# EAGLE schematic CurrentSensingConverter (EAGLE 6.6.0)
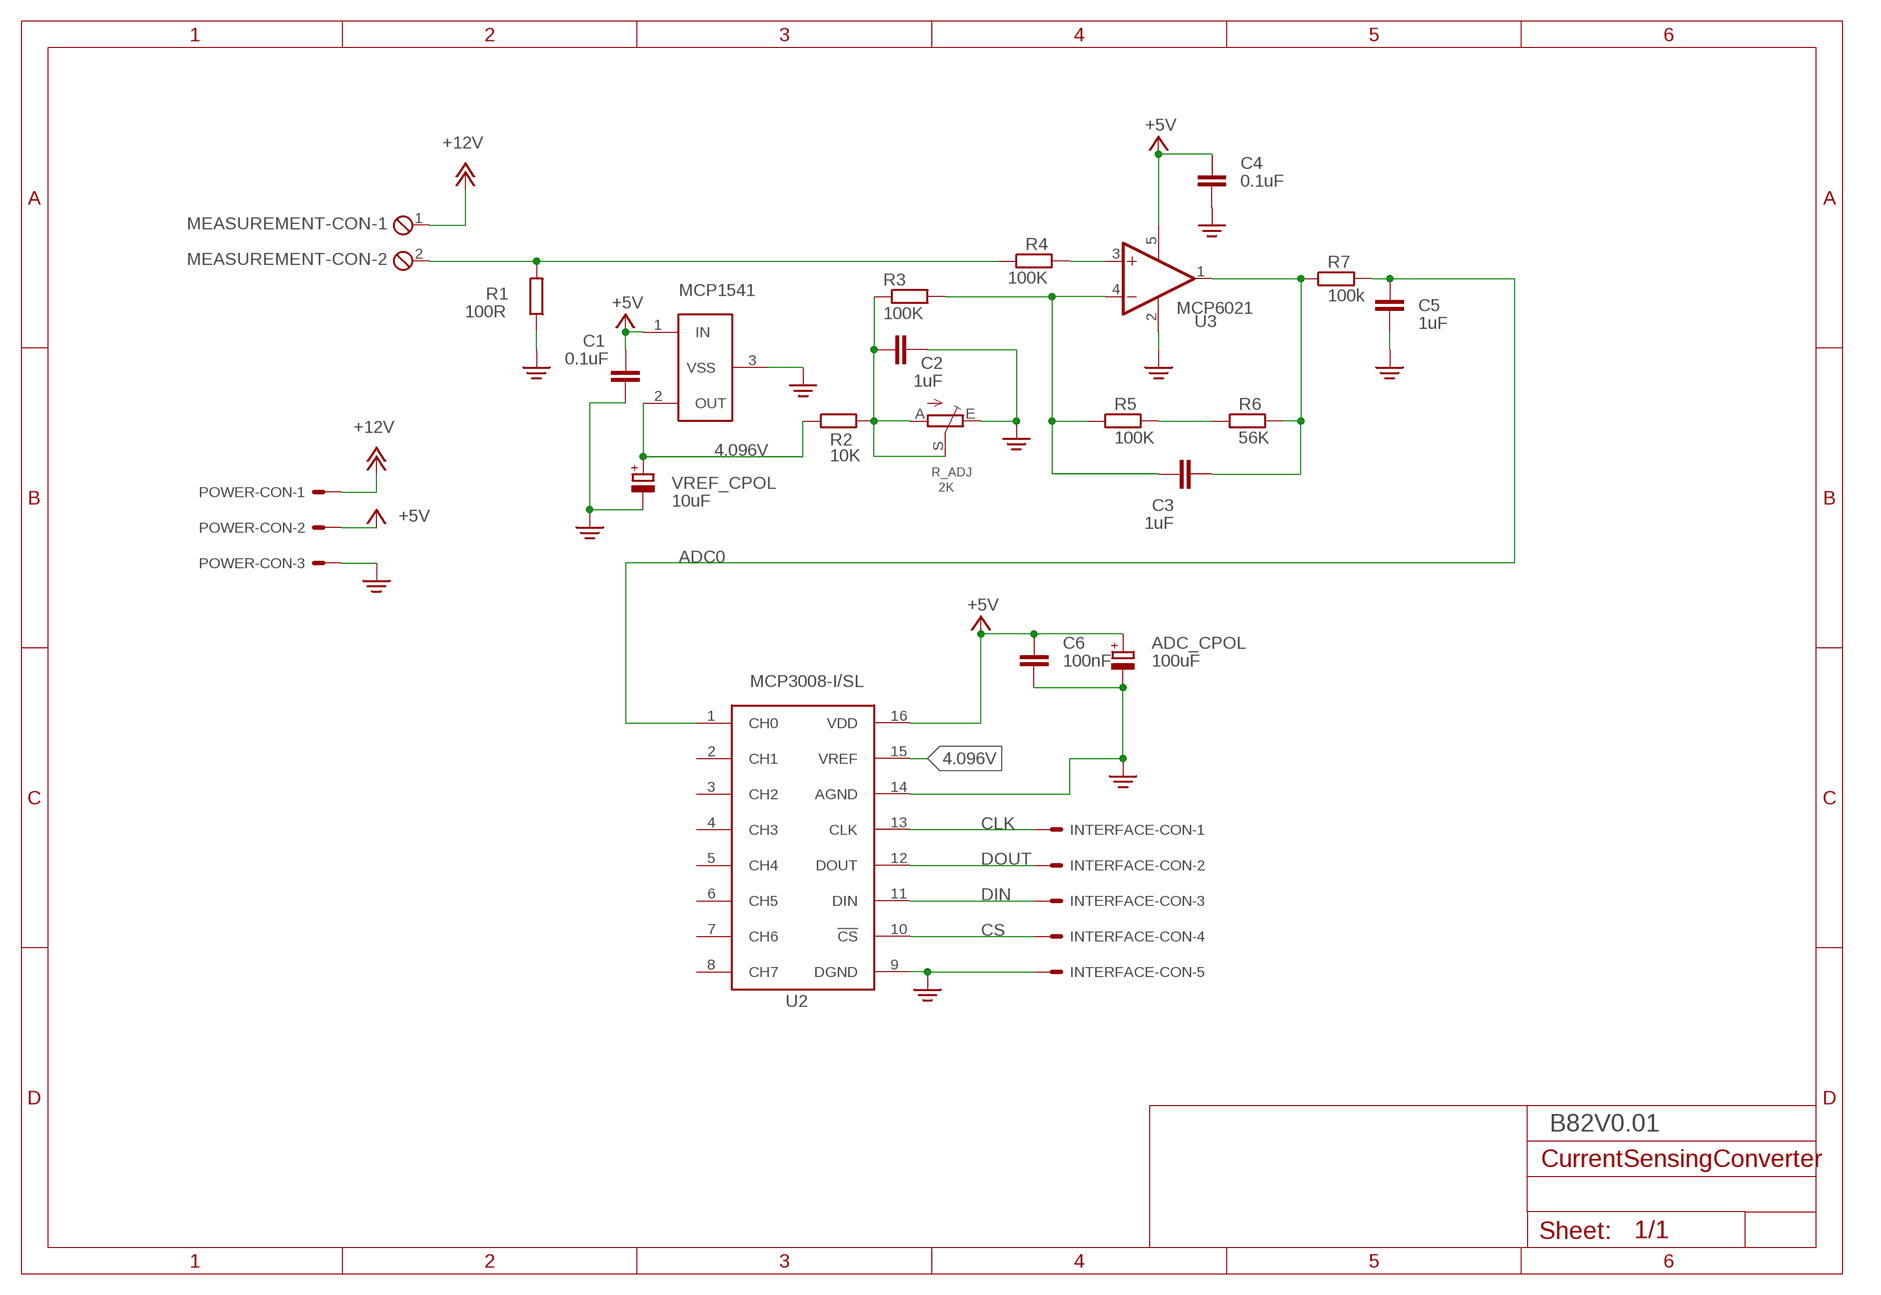
[diagram p0: schematic, sheet 1]

## Parts
ADC_CPOL  100uF  CPOL-EUD/7343-31R  [D/7343-31R]
C1  0.1uF  C-EUC1206  [C1206]
C2  1uF  C-EUC1206  [C1206]
C3  1uF  C-EUC1206  [C1206]
C4  0.1uF  C-EUC1206  [C1206]
C5  1uF  C-EUC1206  [C1206]
C6  100nF  C-EUC1206  [C1206]
INTERFACE-CON  22-05-7058-05  [7395-05]
MEASUREMENT-CON  MPT2  [2POL254]
POWER-CON  22-05-7038-03  [7395-03]
R1  100R  R-EU_R1206  [R1206]
R2  10K  R-EU_R1206  [R1206]
R3  100K  R-EU_R1206  [R1206]
R4  100K  R-EU_R1206  [R1206]
R5  100K  R-EU_R1206  [R1206]
R6  56K  R-EU_R1206  [R1206]
R7  100k  R-EU_R1206  [R1206]
R_ADJ  2K  TRIM_EU-B25P  [B25P]
U1  U1  MCP1541T-I/TT  [SOT23]
U2  MCP3008-I/SL  [SO16]
U3  MCP6021  MCP6021-SOT23  [SOT23-5L]
VREF_CPOL  10uF  CPOL-EUD/7343-31R  [D/7343-31R]

## Nets
4.096V: R2.1 U1.2(OUT) U2.15(VREF) VREF_CPOL.+
+5V: ADC_CPOL.+ C1.1 C4.1 C6.1 POWER-CON.2 U1.1(IN) U2.16(VDD) U3.5(V+)
+12V: MEASUREMENT-CON.1 POWER-CON.1
ADC0: C5.1 R7.2 U2.1(CH0)
CLK: INTERFACE-CON.1 U2.13(CLK)
CS: INTERFACE-CON.4 U2.10(!CS)
DIN: INTERFACE-CON.3 U2.11(DIN)
DOUT: INTERFACE-CON.2 U2.12(DOUT)
N$1: C3.1 R3.2 R5.1 U3.4(-IN)
N$2: R5.2 R6.1
N$3: C3.2 R6.2 R7.1 U3.1(OUT)
N$5: MEASUREMENT-CON.2 R1.2 R4.1
N$6: R4.2 U3.3(+IN)
N$7: C2.1 R2.2 R3.1 R_ADJ.A R_ADJ.S
PE: ADC_CPOL.- C1.2 C2.2 C4.2 C5.2 C6.2 INTERFACE-CON.5 POWER-CON.3 R1.1 R_ADJ.E U1.3(VSS) U2.9(DGND) U2.14(AGND) U3.2(V-) VREF_CPOL.-
Unconnected: U2.2(CH1) U2.3(CH2) U2.4(CH3) U2.5(CH4) U2.6(CH5) U2.7(CH6) U2.8(CH7)

## Notes on the sheet
- B82V0.01

## Library data of the parts
ADC_CPOL VREF_CPOL = rcl:CPOL-EU: POLARIZED CAPACITOR, European symbol
C1-C6 = rcl:C-EU: CAPACITOR, European symbol
INTERFACE-CON = con-molex:22-?-05: CONNECTOR wire to board 2.54 mm (.1 inch) pitch header; OC_FARNELL: unknown; OC_NEWARK: unknown
MEASUREMENT-CON = con-phoenix-254:MPT2: PHOENIX CONNECTOR; OC_FARNELL: unknown; OC_NEWARK: unknown
POWER-CON = con-molex:22-?-03: CONNECTOR wire to board 2.54 mm (.1 inch) pitch header; OC_FARNELL: unknown; OC_NEWARK: unknown
R1-R7 = resistor:R-EU_: RESISTOR, European symbol
R_ADJ = pot:TRIM_EU-: POTENTIOMETER
U1 = simon:MCP1541T-I/TT: Voltage Reference, Precision, Series - Fixed, MCP1541 Series, 4.096V, SOT-23-3
U2 = simon:MCP3008*: 2.7V 8-Channel 10 bit ADC with SPI
U3 = simon:MCP6021-SOT23: Created by Simon, 8May2023